# Altium schematic sheet 12V_Converter.SchDoc
size A; SheetNumber: 7; SheetTotal: 9
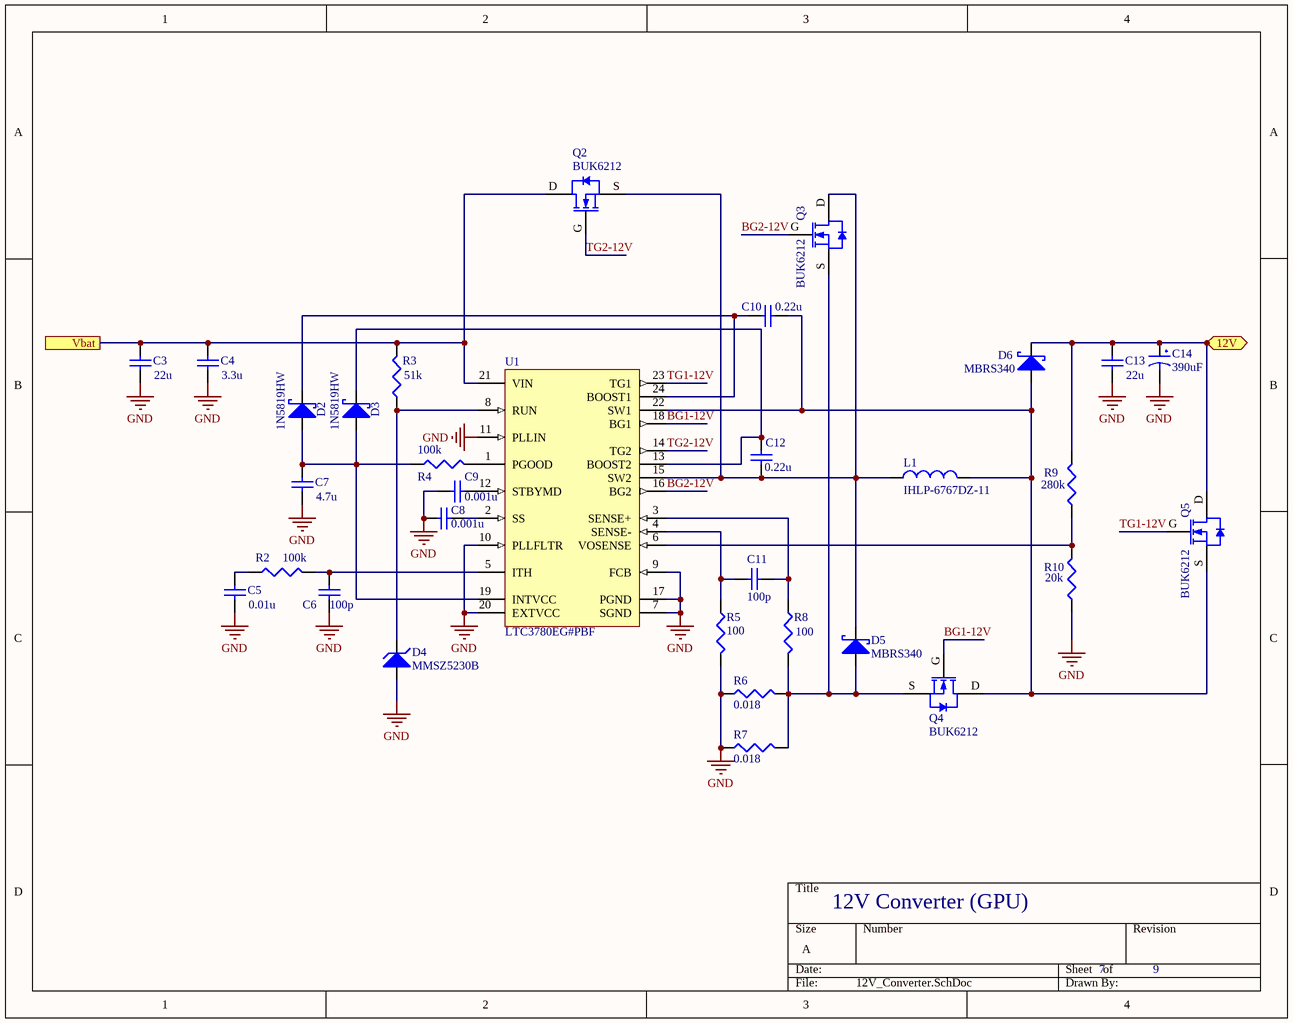
[diagram p0: 12V_Converter.SchDoc]

## Parts
C3  value 22u  [C1206]  (hidden comment: Cap Semi)
C4  value 3.3u  [C1206]  (hidden comment: Cap Semi)
C5  value 0.01u  [C1206]  (hidden comment: Cap Semi)
C6  value 100p  [C1206]  (hidden comment: Cap Semi)
C7  value 4.7u  [C1206]  (hidden comment: Cap Semi)
C8  value 0.001u  [C1206]  (hidden comment: Cap Semi)
C9  value 0.001u  [C1206]  (hidden comment: Cap Semi)
C10  value 0.22u  [C1206]  (hidden comment: Cap Semi)
C11  value 100p  [C1206]  (hidden comment: Cap Semi)
C12  value 0.22u  [C1206]  (hidden comment: Cap Semi)
C13  value 22u  [C1206]  (hidden comment: Cap Semi)
C14  390uF  [PCVxxxxxMCLxGS]
D2  1N5819HW  [1N58xx]
D3  1N5819HW  [1N58xx]
D4  MMSZ5230B  [ONSC-SOD-123-2-425-04_V]
D5  MBRS340  [MBRS340]
D6  MBRS340  [MBRS340]
L1  IHLP-6767DZ-11  [IHLP-6767DZ-11]
Q2  BUK6212  [NXP-SOT428_M]
Q3  BUK6212  [NXP-SOT428_M]
Q4  BUK6212  [NXP-SOT428_M]
Q5  BUK6212  [NXP-SOT428_M]
R2  value 100k  [J1-0603]  (hidden comment: Res3)
R3  value 51k  [J1-0603]  (hidden comment: Res3)
R4  value 100k  [J1-0603]  (hidden comment: Res3)
R5  value 100  [J1-0603]  (hidden comment: Res3)
R6  value 0.018  [R1206]  (hidden comment: Res3)
R7  value 0.018  [R1206]  (hidden comment: Res3)
R8  value 100  [J1-0603]  (hidden comment: Res3)
R9  value 280k  [J1-0603]  (hidden comment: Res3)
R10  value 20k  [J1-0603]  (hidden comment: Res3)
U1  LTC3780EG#PBF  [LT-G-24_L]

## Ports
12V (bidir), Vbat

## Nets
GND: C3.1 C4.1 C5.1 C6.1 C7.1 C8.1 C9.1 C13.1 C14.2 D4.2(A) R5.2 R6.1 R7.1 R10.1 U1.7(SGND) U1.9(FCB) U1.10(PLLFLTR) U1.11(PLLIN) U1.17(PGND) U1.20(EXTVCC)
12V: C13.2 C14.1 D6.K(Cathode) Q5.D R9.2 ; port 12V
BG1-12V: Q4.G U1.18(BG1)
BG2-12V: Q3.G U1.16(BG2)
TG1-12V: Q5.G U1.23(TG1)
TG2-12V: Q2.G U1.14(TG2)
Vbat: C3.2 C4.2 Q2.D R3.2 U1.21(VIN) ; port Vbat
NetC5_2: C5.2 R2.1
NetC6_2: C6.2 R2.2 U1.5(ITH)
NetC7_2: C7.2 D2.A(Anode) D3.A(Anode) R4.1 U1.19(INTVCC)
NetC8_2: C8.2 U1.2(SS)
NetC9_2: C9.2 U1.12(STBYMD)
NetC10_1: C10.1 D6.A(Anode) L1.2 Q4.D Q5.S U1.22(SW1)
NetC10_2: C10.2 D2.K(Cathode) U1.24(BOOST1)
NetC11_1: C11.1 R5.1 U1.4(SENSE-)
NetC11_2: C11.2 R8.1 U1.3(SENSE+)
NetC12_1: C12.1 D5.K(Cathode) L1.1 Q2.S Q3.D U1.15(SW2)
NetC12_2: C12.2 D3.K(Cathode) U1.13(BOOST2)
NetD4_1: D4.1(K) R3.1 U1.8(RUN)
NetD5_A: D5.A(Anode) Q3.S Q4.S R6.2 R7.2 R8.2
NetR4_2: R4.2 U1.1(PGOOD)
NetR9_1: R9.1 R10.2 U1.6(VOSENSE)

## Notes on the sheet
- 12V Converter (GPU)

## Library data of the parts
C3-C13 = Cap Semi: Capacitor (Semiconductor SIM Model); Published: 8-Jun-2000; LatestRevisionDate: 29-May-2009; LatestRevisionNote: IPC-7351 Footprint Added.; PackageReference: C1206; Publisher: Altium Limited; PackageDescription: Chip Capacitor
C14 = PCV1E391MCL2GS: CAP ALUM POLY 390UF 20% 25V SMD; Digikey: https://www.digikey.com/product-detail/en/nichicon/PCV1E391MCL2GS/493-4544-1-ND/2786841; Datasheet: http://nichicon-us.com/english/products/pdfs/e-pcv.pdf
D2 D3 = 1N58xx: 1A Schottky Barrier Rectifier Diode; Datasheet: http://www.kesenes.com/pdf/1n5817-1n5819.pdf
D4 = MMSZ5230BT1G: Zener Voltage Regulator, 500 mW, 2-Pin SOD-123, Pb-Free, Tape and Reel; Manufacturer: On Semiconductor; P Max (W): 0.5; VZ Typ (V): 4.7; DatasheetVersion: Rev. 12; PackageVersion: Rev. G, 10/2009; PackageReference: SOD-123-2-425-04; PackageDescription: 2-Pin SOD, Body 1.6 x 2.69 mm; Supplier 1: Digi-Key; Supplier Part Number 1: MMSZ5230BT1GOSTR-ND; Supplier 2: Digi-Key; Supplier Part Number 2: MMSZ5230BT1GOSCT-ND; Supplier 3: Digi-Key; Supplier Part Number 3: MMSZ5230BT1GOSDKR-ND; Supplier 4: Farnell; Supplier Part Number 4: 1431272; Supplier 5: Farnell; Supplier Part Number 5: 1431272RL; Supplier 6: Farnell; Supplier Part Number 6: 2370826; Supplier 7: Newark; Supplier Part Number 7: 83H7423; Supplier 8: Newark; Supplier Part Number 8: 67R1368; Supplier 9: Mouser; Supplier Part Number 9: 863-MMSZ5230BT1G; Packing: Tape and Reel; RoHS: Pb-Free; Mounting Technology: Surface Mount; PartNumber: MMSZ5230BT1G; ComponentLink1Description: Manufacturer URL; ComponentLink1URL: http://www.onsemi.com/; ComponentLink2Description: Datasheet; ComponentLink2URL: http://www.onsemi.com/pub_link/Collateral/MMSZ5221BT1-D.PDF; ComponentLink3Description: Package Specification; ComponentLink3URL: http://www.onsemi.com/pub_link/Collateral/425-04.PDF
D5 D6 = MBRS340: Schottky Rectifier; Datasheet: https://www.mouser.com/ds/2/308/MBRS340-1120985.pdf
L1 = IHLP-6767DZ-11: 15µH Shielded Molded Inductor 14A 14.4 mOhm Max Nonstandard; Datasheet: http://www.vishay.com/docs/34306/lp67dz11.pdf; Digikey: https://www.digikey.com/product-detail/en/vishay-dale/IHLP6767GZER150M11/541-1287-1-ND/2139413
Q2-Q5 = BUK6212: N-Channel TrenchMOS Intermediate Level FET, 40 V, 50 A, 3-Pin SOT428, Tape and Reel; Manufacturer: NXP Semiconductors; PartNumber: BUK6212-40C,118; Automotive Qualified: Y; Channel Type: N; ID [max] (A): 50; IDM [max] (A): 233; Packing: Tape & Reel; Qr [typ] (nC): 38; VDS [max] (V): 40; VGSth [typ] (V): 2.3; DatasheetVersion: Rev. 2; PackageVersion: 14-06-10, 06/2014; PackageReference: SOT428; PackageDescription: 3-Pin Plastic Single-ended Surface Mounted Package, Body 6.1 x 6.6 mm, Pitch 2.285 mm; Supplier 1: Digi-Key; Supplier Part Number 1: 568-6983-2-ND; Supplier 2: Digi-Key; Supplier Part Number 2: 568-6983-1-ND; Supplier 3: Digi-Key; Supplier Part Number 3: 568-6983-6-ND; Supplier 4: Mouser; Supplier Part Number 4: 771-BUK621240C118; Mounting Technology: Surface Mount; Code_JEITA: SC-63; Code_JEDEC: TO-252; ComponentLink1Description: Manufacturer URL; ComponentLink1URL: http://www.nxp.com/; ComponentLink2Description: Datasheet; ComponentLink2URL: http://www.nxp.com/documents/data_sheet/BUK6212-40C.pdf; ComponentLink3Description: Package Specification; ComponentLink3URL: http://www.nxp.com/documents/outline_drawing/sot428_po.pdf
R2-R10 = Res3: Resistor; Published: 8-Jun-2000; LatestRevisionDate: 29-May-2009; LatestRevisionNote: IPC-7351 Footprint Added.; PackageReference: J1-0603; Publisher: Altium Limited; PackageDescription: Chip Resistor
U1 = LTC3780EG#PBF: Buck-boost Controller, Constant Frequency, Current Mode Control with Power Good Output, 24-pin SOP (G-24), -40 to 85 degC, Pb-Free; Manufacturer: Linear Technology; Frequency Sync Range: 200kHz - 400kHz; Number of Outputs: 1; DatasheetVersion: Rev. F; PackageVersion: Jun-10; PackageReference: G-24; PackageDescription: 24-Pin Plastic SSOP, Body 8.2 x 5.3 mm, Pitch 0.65 mm; Supplier 1: Digi-Key; Supplier Part Number 1: LTC3780EG#PBF-ND; Supplier 2: Farnell; Supplier Part Number 2: 1273545; Supplier 3: Newark; Supplier Part Number 3: 56M8395; RoHS: TRUE; Mounting Technology: Surface Mount; PartNumber: LTC3780EG#PBF; ComponentLink1Description: Manufacturer URL; ComponentLink1URL: http://www.linear.com/; ComponentLink2Description: Datasheet; ComponentLink2URL: http://cds.linear.com/docs/en/datasheet/3780ff.pdf; ComponentLink3Description: Package Specification; ComponentLink3URL: http://cds.linear.com/docs/en/packaging/SSOP_24_05-08-1640.pdf